# Altium project AVCC_PROJECT.PrjPcb
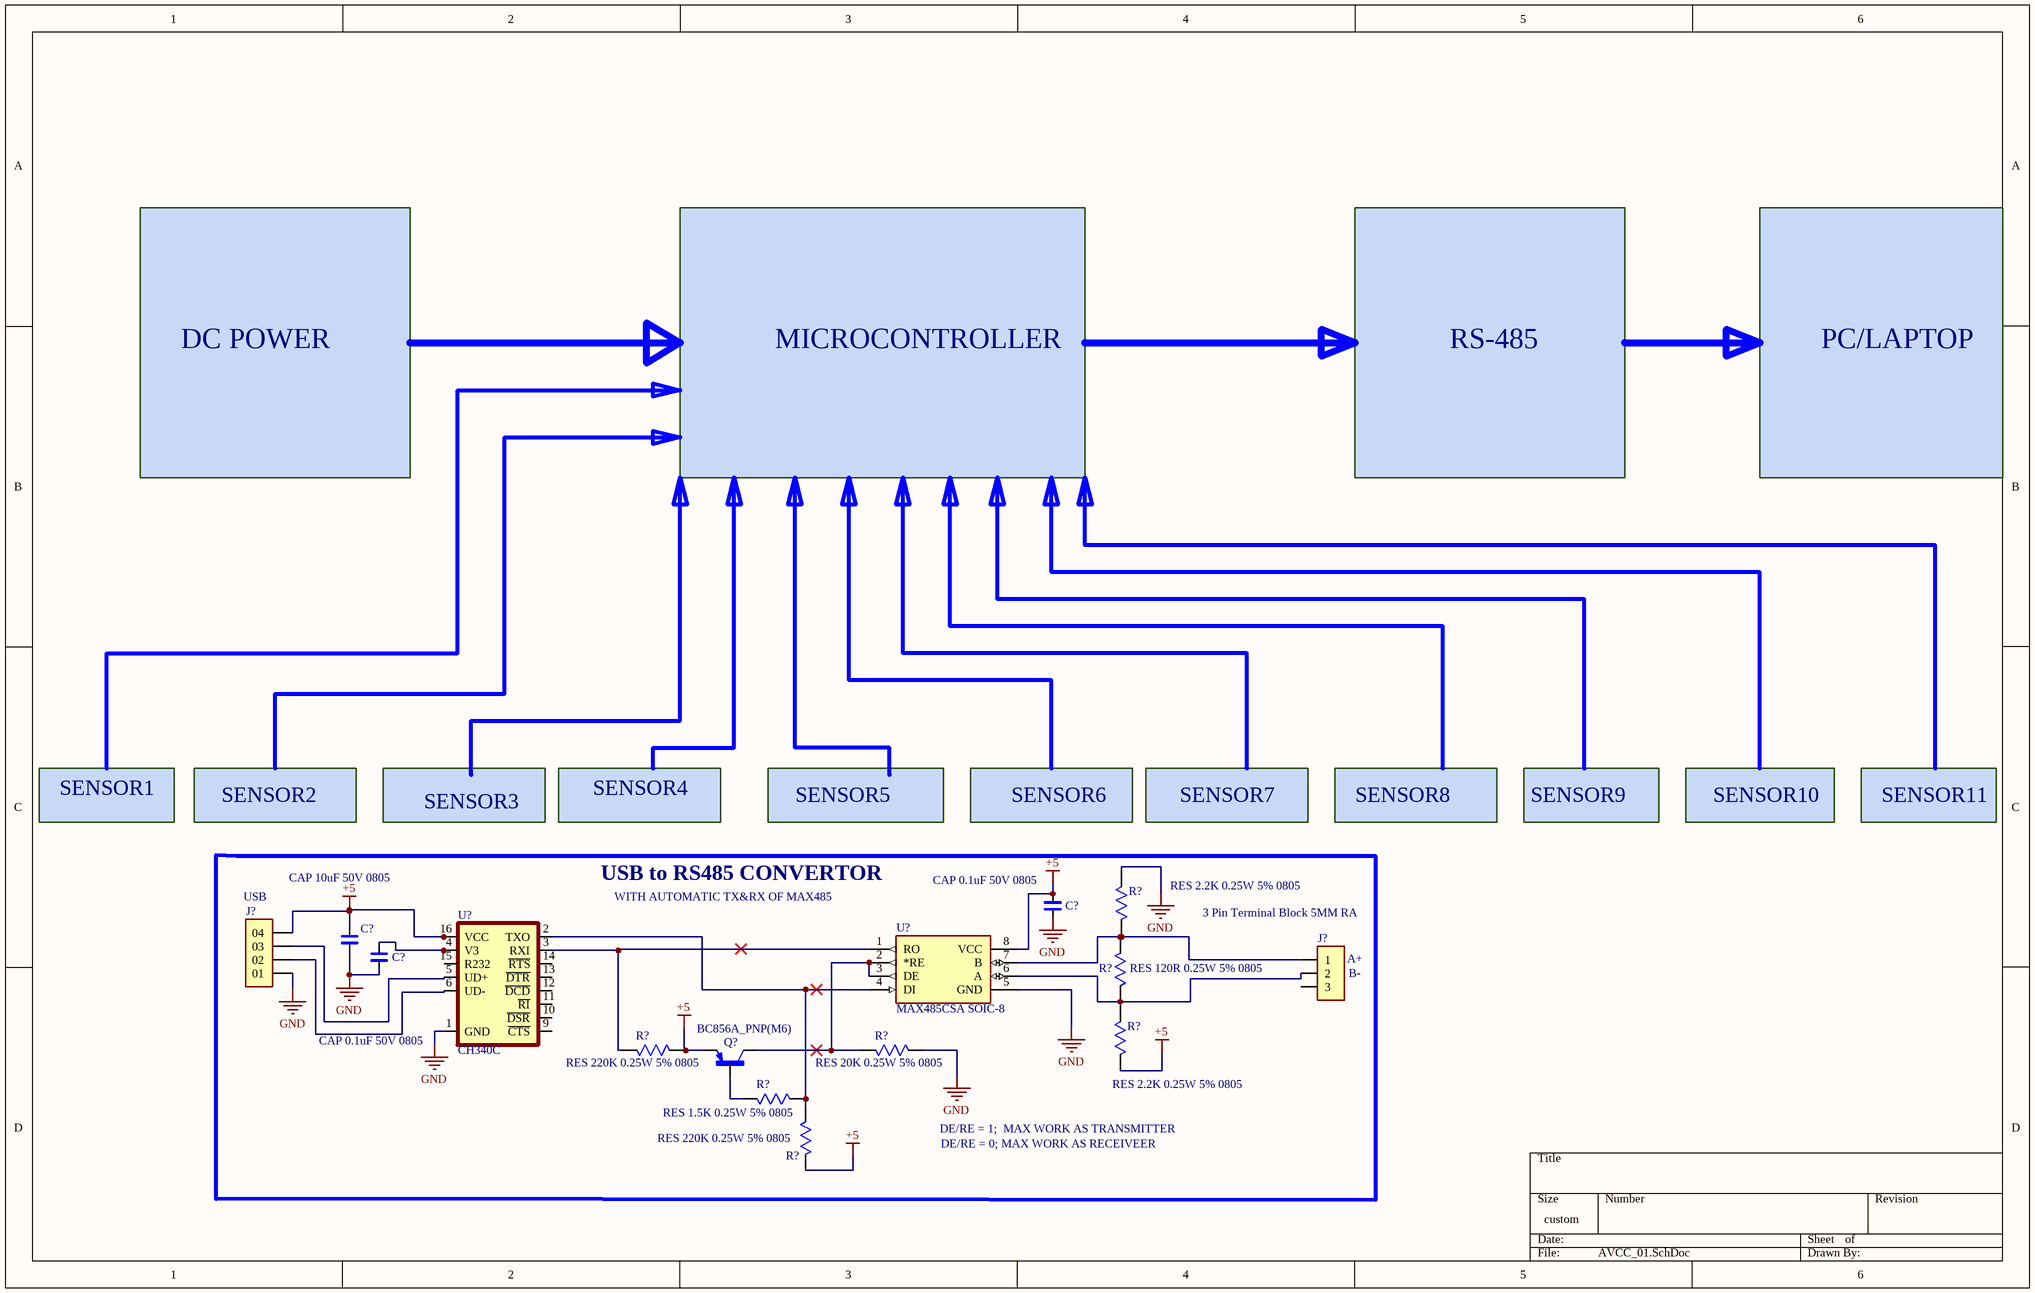
[diagram p0: AVCC_01.SchDoc]
3 sheets, 125 parts. Net scope: global (net labels, ports and power ports of the same name join across sheets).
Board file: AVCC_PROJECT.PcbDoc
Sheets:
  AVCC_01.SchDoc
  AVCC_2.SchDoc
  AVCC_3.SchDoc

## Sheet AVCC_01.SchDoc
size 381 x 241 mm; SheetNumber: 1; SheetTotal: 3

### Parts
(Parts that share a designator on the sheet are numbered #1, #2 ... from top to bottom, then left to right.)
C?#1  CAP 0.1uF 50V 0805  [CAP CER 0.1uF/50V 5%]
C?#2  CAP 10uF 50V 0805  [CAP CER 0.1uF/50V 5%]
C?#3  CAP 0.1uF 50V 0805  [CAP CER 0.1uF/50V 5%]
J?#1  USB  [BURGE 4 PIN 2.54mm]
J?#2  3 Pin Terminal Block 5MM RA  [3 Pin Terminal Block 5MM RA]
Q?  BC856A_PNP(M6)  [TRANS_BC856A_RFG]
R?#1  RES 2.2K 0.25W 5% 0805  [RES 0805 10K/0.25W 5%]
R?#2  RES 120R 0.25W 5% 0805  [RES 0805 10K/0.25W 5%]
R?#3  RES 2.2K 0.25W 5% 0805  [RES 0805 10K/0.25W 5%]
R?#4  RES 220K 0.25W 5% 0805  [RES 0805 10K/0.25W 5%]
R?#5  RES 20K 0.25W 5% 0805  [RES 0805 10K/0.25W 5%]
R?#6  RES 1.5K 0.25W 5% 0805  [RES 0805 10K/0.25W 5%]
R?#7  RES 220K 0.25W 5% 0805  [RES 0805 10K/0.25W 5%]
U?#1  MAX485CSA SOIC-8  [MAX485CSA]
U?#2  CH340C  [SO016]

### Nets
+5: C?#1.1 C?#2.1 J?#1.04 Q?.2(E) R?#3.2 R?#4.2 R?#7.2 U?#1.8(VCC) U?#2.16(VCC)
GND: C?#1.2 C?#2.2 C?#3.2 J?#1.01 R?#1.1 R?#5.2 U?#1.5(GND) U?#2.1(GND)
NetC?#3_1: C?#3.1 U?#2.4(V3)
NetJ?#1_02: J?#1.02 U?#2.6(UD-)
NetJ?#1_03: J?#1.03 U?#2.5(UD+)
NetJ?#2_1: J?#2.1 R?#1.2 R?#2.1 U?#1.7(B)
NetJ?#2_2: J?#2.2 R?#2.2 R?#3.1 U?#1.6(A)
NetQ?_1: Q?.1(B) R?#6.1
NetQ?_3: Q?.3(C) R?#5.1 U?#1.2(*RE) U?#1.3(DE)
NetR?#4_1: R?#4.1 U?#1.1(RO) U?#2.3(RXI)
NetR?#6_2: R?#6.2 R?#7.1 U?#1.4(DI) U?#2.2(TXO)

Not connected (* = marked no-connect by the designer): J?#2 3; U?#2 9(~{CTS}) 10(~{DSR}) 11(~{RI}) 12(~{DCD}) 13(~{DTR}) 14(~{RTS}) 15(R232)

### Notes on the sheet
- DC POWER
- MICROCONTROLLER
- RS-485
- PC/LAPTOP
- SENSOR1
- SENSOR2
- SENSOR3
- SENSOR4
- SENSOR5
- SENSOR6
- SENSOR7
- SENSOR8
- SENSOR9
- SENSOR10
- SENSOR11
- USB to RS485 CONVERTOR
- WITH AUTOMATIC TX&RX OF MAX485
- (near J?#2) A+
- (near J?#2) B-
- DE/RE = 1;  MAX WORK AS TRANSMITTER
- DE/RE = 0; MAX WORK AS RECEIVEER

### Library data of the parts
C?#1-C?#3 = CAP CER 0.1uF/50V 5%: CAP CER 0.1uF/50V  Ceramic Capacitor X7R 0805 (2012 Metric) SMT; MF: Samsung; MP: CL21B104KCFNNNE; Purchase-URL: https://pricing.snapeda.com/search?q=CL21B104KCFNNNE&ref=eda; Package: 0805 Samsung; Check_prices: https://www.snapeda.com/parts/CL21B104KCFNNNE/Samsung+Electro-Mechanics/view-part/?ref=eda; Value: *; SnapEDA_Link: https://www.snapeda.com/parts/CL21B104KCFNNNE/Samsung+Electro-Mechanics/view-part/?ref=snap; Digi-Key_Part_Number: 1276-6840-2-ND
J?#1 = BURGE 4 PIN 2.54mm: Conn Unshrouded Header HDR 4 POS 2.54mm Solder ST Top Entry Thru-Hole Bulk TSW-104-17-G-S-LL; MF: Samtec; MP: TSW-104-23-H-S-LL; SnapEDA_Link: https://www.snapeda.com/parts/TSW-104-23-H-S-LL/Samtec/view-part/?ref=snap; Package: None; Value: *; Check_prices: https://www.snapeda.com/parts/TSW-104-23-H-S-LL/Samtec/view-part/?ref=eda
J?#2 = 3 Pin Terminal Block 5MM RA: 3 Pin Terminal Block HDR 5MM THT RA 231-433_001-000; MP: 231-433/001-000; MF: WAGO; SnapEDA_Link: https://www.snapeda.com/parts/231-433/001-000/WAGO/view-part/482062/?ref=snap; Package: None; Availability: Unavailable; Price: None; Value: *
Q? = BC856A_RFG: Package: None; Price: None; Value: *; MP: BC856A_RFG; Availability: Unavailable
R?#1-R?#7 = RES 10K 0.25W 5% 0805: RESISTOR, THICK FILM, 10K, 5%, 0805 0.25W SMT; MP: ERJ-6GEYJ103V; MF: Panasonic Electronic; Price: None; Check_prices: https://www.snapeda.com/parts/ERJ-6GEYJ103V/Panasonic+Electronic+Components/view-part/?ref=eda; Package: 805-2 Panasonic; Purchase-URL: https://pricing.snapeda.com/search/part/ERJ-6GEYJ103V/?ref=eda; Availability: In Stock; SnapEDA_Link: https://www.snapeda.com/parts/ERJ-6GEYJ103V/Panasonic+Electronic+Components/view-part/?ref=snap; Value: *
U?#1 = MAX485CSA: MAX485CSA-RS-485/RS-422 Transceivers, SOIC-8; MF: Analog Devices; MP: MAX485CSA+; SnapEDA_Link: https://www.snapeda.com/parts/MAX485CSA+/Analog+Devices/view-part/?ref=snap; Package: SOIC-8 Maxim; Value: *; Check_prices: https://www.snapeda.com/parts/MAX485CSA+/Analog+Devices/view-part/?ref=eda
U?#2 = CH340C: Replacement for Brother P-Touch; MF: Olimex; SnapEDA_Link: https://www.snapeda.com/parts/CH340C/Olimex/view-part/?ref=snap; Package: None; Value: *; MP: CH340C; Check_prices: https://www.snapeda.com/parts/CH340C/Olimex/view-part/?ref=eda

## Sheet AVCC_2.SchDoc
size 381 x 241 mm; SheetNumber: 2; SheetTotal: 3
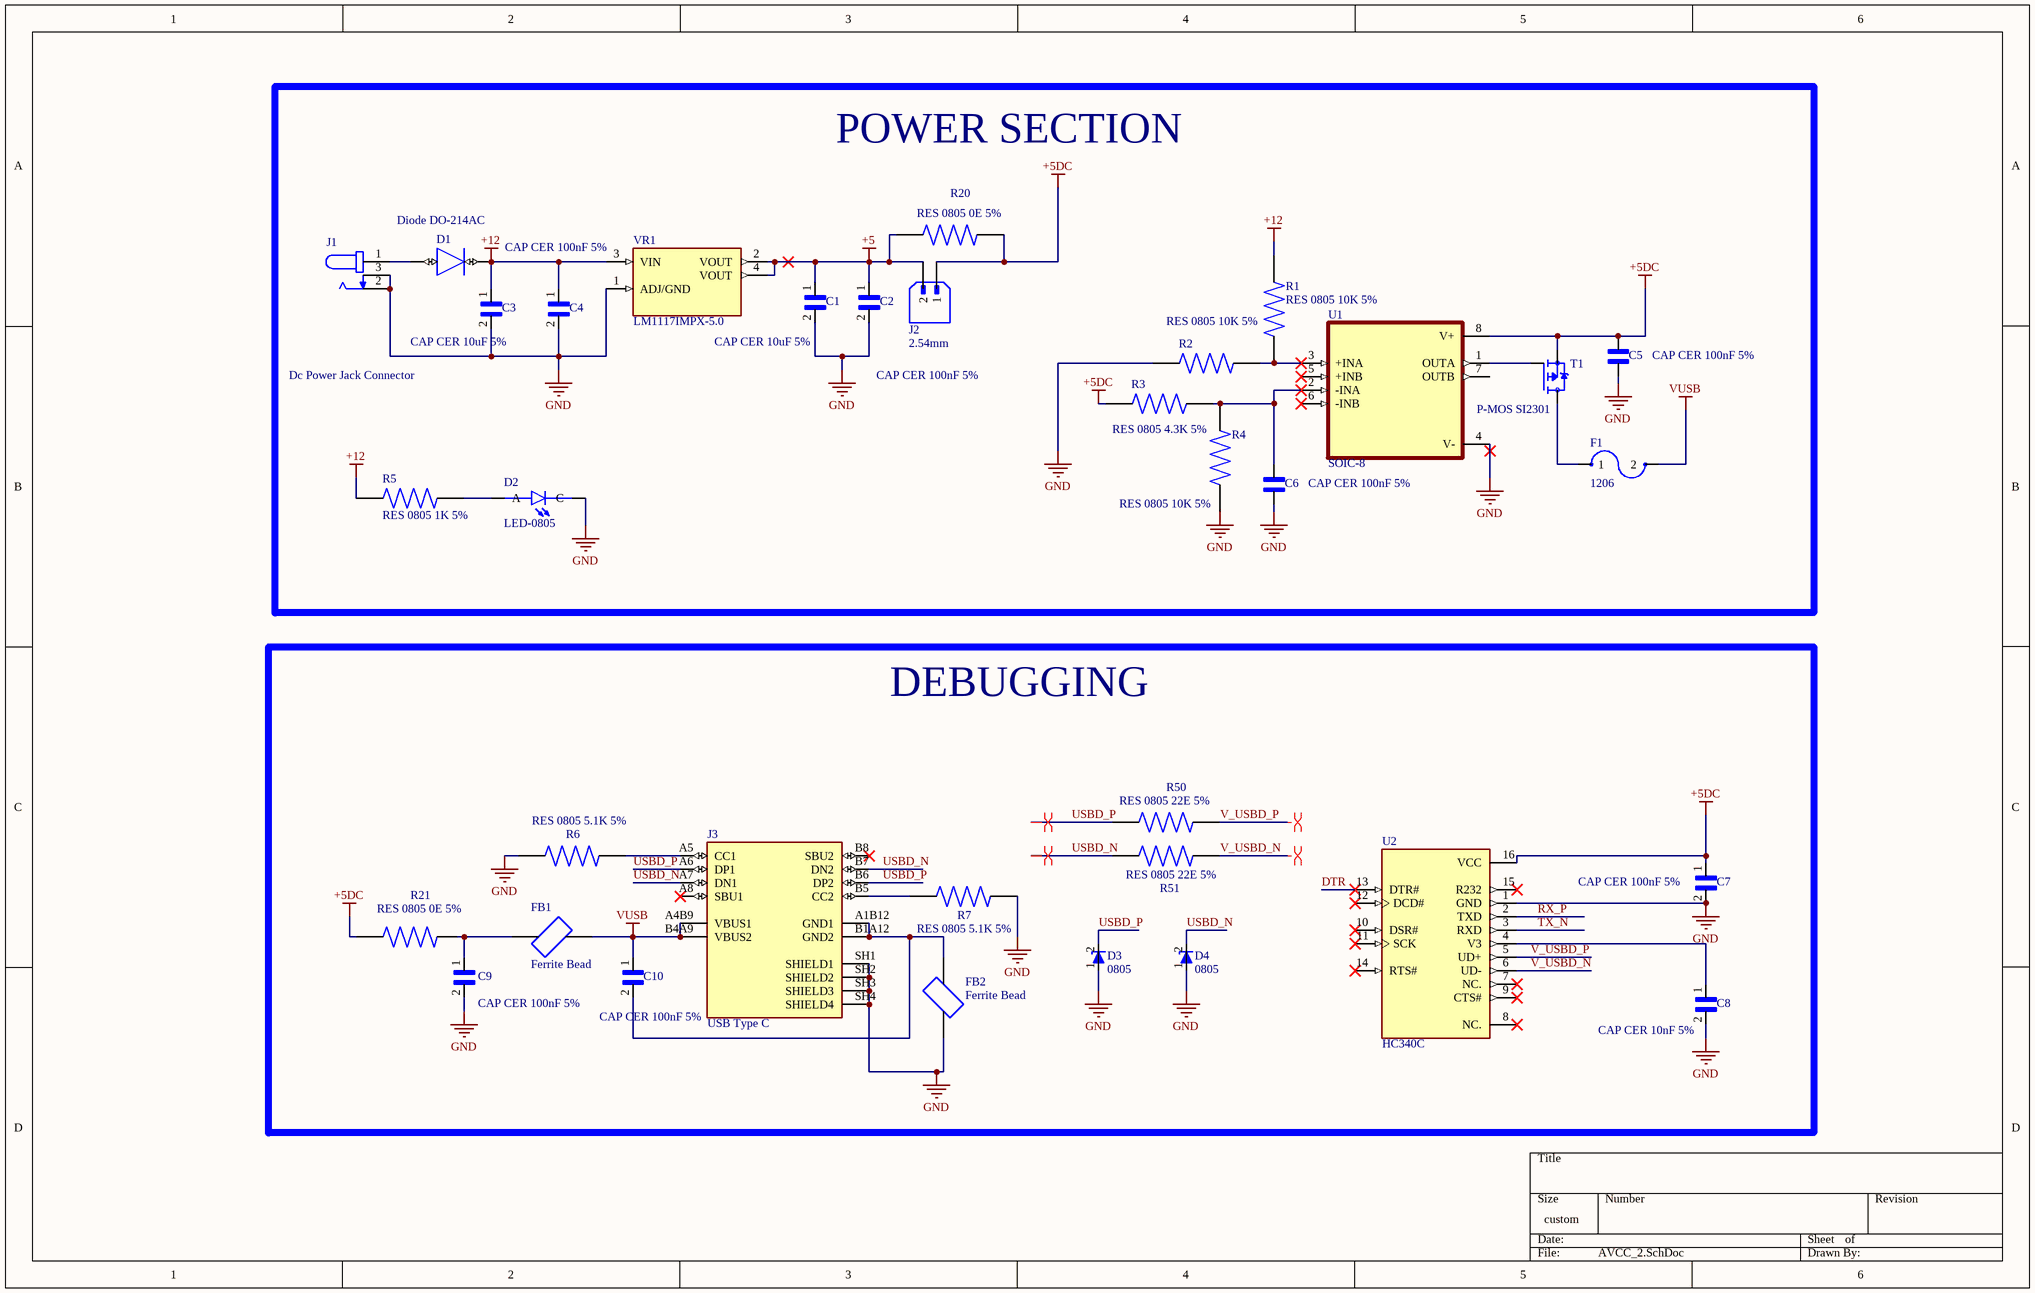
[diagram p1: AVCC_2.SchDoc]

### Parts
C1  CAP CER 10uF 5%  [CAP CER 100pF 5%]
C2  CAP CER 100nF 5%  [CAP CER 100pF 5%]
C3  CAP CER 10uF 5%  [CAP CER 100pF 5%]
C4  CAP CER 100nF 5%  [CAP CER 100pF 5%]
C5  CAP CER 100nF 5%  [CAP CER 100pF 5%]
C6  CAP CER 100nF 5%  [CAP CER 100pF 5%]
C7  CAP CER 100nF 5%  [CAP CER 100pF 5%]
C8  CAP CER 10nF 5%  [CAP CER 100pF 5%]
C9  CAP CER 100nF 5%  [CAP CER 100pF 5%]
C10  CAP CER 100nF 5%  [CAP CER 100pF 5%]
D1  Diode DO-214AC  [Diode DO-214AC]
D2  LED-0805  [LED-0805]
D3  0805  [TVS Diode,Uni-Directional, 4-Pin]
D4  0805  [TVS Diode,Uni-Directional, 4-Pin]
F1  1206  [FUSE]
FB1  Ferrite Bead  [Ferrite Bead]
FB2  Ferrite Bead  [Ferrite Bead]
J1  Dc Power Jack Connector  [Dc Power Jack Connector]
J2  2.54mm  [JST_2PIN]
J3  USB Type C  [USB Type C MOLEX]
R1  RES 0805 10K 5%  [RES 0805 10K 5%]
R2  RES 0805 10K 5%  [RES 0805 10K 5%]
R3  RES 0805 4.3K 5%  [RES 0805 10K 5%]
R4  RES 0805 10K 5%  [RES 0805 10K 5%]
R5  RES 0805 1K 5%  [RES 0805 10K 5%]
R6  RES 0805 5.1K 5%  [RES 0805 10K 5%]
R7  RES 0805 5.1K 5%  [RES 0805 10K 5%]
R20  RES 0805 0E 5%  [RES 0805 10K 5%]
R21  RES 0805 0E 5%  [RES 0805 10K 5%]
R50  RES 0805 22E 5%  [RES 0805 10K 5%]
R51  RES 0805 22E 5%  [RES 0805 10K 5%]
T1  P-MOS SI2301  [PMOS_SOT23]
U1  SOIC-8  [OPAMP]
U2  HC340C  [HC340C]
VR1  LM1117IMPX-5.0  [LM1117IMPX-5.0]

### Blocks framed on the sheet
POWER SECTION: C1-C6 D1 D2 F1 J1 J2 R1-R5 R20 T1 U1 VR1
DEBUGGING: C7-C10 D3 D4 FB1 FB2 J3 R6 R7 R21 R50 R51 U2

### Nets
+5: C1.1 C2.1 J2.2 R20.1 VR1.2(VOUT) VR1.4(VOUT)
+5DC: C5.1 C7.1 J2.1 R3.1 R20.2 R21.1 T1.2(S) U1.8(V+) U2.16(VCC)
+12: C3.1 C4.1 D1.1(K) R1.2 R5.1 VR1.3(VIN)
GND: C1.2 C2.2 C3.2 C4.2 C5.2 C6.2 C7.2 C8.2 C9.2 D2.C D3.1(GND) D4.1(GND) FB2.1 J1.2 J1.3 J3.SH1(SHIELD1) J3.SH2(SHIELD2) J3.SH3(SHIELD3) J3.SH4(SHIELD4) R2.1 R4.1 R6.1 R7.2 U1.4(V-) U2.1(GND) VR1.1(ADJ/GND)
VUSB: C10.1 F1.2 FB1.2 J3.A4B9(VBUS1) J3.B4A9(VBUS2)
DTR: U2.13(DTR#)
RX_P: U2.2(TXD)
TX_N: U2.3(RXD)
USBD_N: D4.2(I/O_1) J3.A7(DN1) J3.B7(DN2) R51.1
USBD_P: D3.2(I/O_1) J3.A6(DP1) J3.B6(DP2) R50.1
V_USBD_N: R51.2 U2.6(UD-)
V_USBD_P: R50.2 U2.5(UD+)
NetC6_1: C6.1 R3.2 R4.2 U1.2(-INA)
NetC8_1: C8.1 U2.4(V3)
NetC9_1: C9.1 FB1.1 R21.2
NetC10_2: C10.2 FB2.2 J3.A1B12(GND1) J3.B1A12(GND2)
NetD1_2: D1.2(A) J1.1
NetD2_A: D2.A R5.2
NetF1_1: F1.1 T1.3(D)
NetJ3_A5: J3.A5(CC1) R6.2
NetJ3_B5: J3.B5(CC2) R7.1
NetR1_1: R1.1 R2.2 U1.3(+INA)
NetT1_1: T1.1(G) U1.1(OUTA)

Not connected (* = marked no-connect by the designer): J3 A8(SBU1)* B8(SBU2)*; U1 5(+INB)* 6(-INB)* 7(OUTB); U2 7(NC.)* 8(NC.)* 9(CTS#)* 10(DSR#)* 11(SCK)* 12(DCD#)* 14(RTS#)* 15(R232)*

### Layout directives
differential pair; differential pair class DIFF_90E: USBD_N, USBD_P, V_USBD_N, V_USBD_P

### Library data of the parts
C1-C10 = CAP CER 100pF 5%: CAP CER 100PF50V X7R 0805; MP: GCJ216R71H222KA01D; Package: None; Price: None; Value: *; Availability: Unavailable
D1 = Diode DO-214AC: Diode Standard 100 V 1A Surface Mount DO-214AC (SMA); MF: Vishay Semiconductor; MP: S1B-E3/61T; SnapEDA_Link: https://www.snapeda.com/parts/S1B-E3/61T/Vishay/view-part/?ref=snap; Package: DO-214 Vishay Semiconductor; Value: *; Check_prices: https://www.snapeda.com/parts/S1B-E3/61T/Vishay/view-part/?ref=eda
D2 = LED-0805: Red 640nm LED Indication - Discrete 1.85V 0805 (2012 Metric); MF: Kingbright; MP: APT2012SRCPRV; SnapEDA_Link: https://www.snapeda.com/parts/APT2012SRCPRV/Kingbright/view-part/?ref=snap; Package: 0805 Kingbright; Value: *; Check_prices: https://www.snapeda.com/parts/APT2012SRCPRV/Kingbright/view-part/?ref=eda
D3 D4 = TVS Diode: Nexperia PRTR5V0U2X,215, Dual-Element Uni-Directional TVS Diode, 0805, 5V; MF: NXP Semiconductors; Check_prices: https://www.snapeda.com/parts/PRTR5V0U2X/NXP+Semiconductors/view-part/?ref=eda; Value: *; Purchase-URL: https://pricing.snapeda.com/search/part/PRTR5V0U2X/?ref=eda; Price: None; MP: PRTR5V0U2X; SnapEDA_Link: https://www.snapeda.com/parts/PRTR5V0U2X/NXP+Semiconductors/view-part/?ref=snap; Availability: In Stock; Package: TO-253-4 Nexperia USA Inc.
F1 = FUSE: C1H25 .5 A 125 V AC 32 V DC Fuse Board Mount (Cartridge Style Excluded) Surface Mount 1206 (3216 Metric); MF: Bel Fuse; SnapEDA_Link: https://www.snapeda.com/parts/C1H25/Bel+Circuit+Protection/view-part/?ref=snap; Package: 1206 Bel Fuse Inc.; Value: *; MP: C1H25; Check_prices: https://www.snapeda.com/parts/C1H25/Bel+Circuit+Protection/view-part/?ref=eda
FB1 FB2 = Ferrite Bead: Ferrite Bead 0805; MP: MPZ2012S102AT000; Package: None; Price: None; Value: *; Availability: Unavailable
J1 = Dc Power Jack Connector: PJ-202AH, 2.0 x 6.5 mm, 5.0 A, Horizontal, Through Hole, Kinked Pins, Dc Power Jack Connector; MF: Same Sky; SnapEDA_Link: https://www.snapeda.com/parts/PJ-202AH/Same+Sky/view-part/?ref=snap; Package: None; Value: *; MP: PJ-202AH; Check_prices: https://www.snapeda.com/parts/PJ-202AH/Same+Sky/view-part/?ref=eda
J2 = JST_2PIN: B2B-XH-A(LF)(SN),Connector Header Through Hole 3 position 0.098 (2.50mm)Connector Header Through Hole 2 position 0.098 (2.50mm); MF: JST Sales; SnapEDA_Link: https://www.snapeda.com/parts/B2B-XH-A(LF)(SN)/JST/view-part/?ref=snap; Package: None; Value: *; MP: B2B-XH-A(LF)(SN); Check_prices: https://www.snapeda.com/parts/B2B-XH-A(LF)(SN)/JST/view-part/?ref=eda
J3 = USB Type C: USB Type C - Connector, Top-mount SMT, 16pos | Molex Incorporated 217179-0001; SnapEDA_Link: https://www.snapeda.com/parts/217179-0001/Molex/view-part/?ref=snap; Package: None; Value: *; MF: Molex; MP: 217179-0001; Check_prices: https://www.snapeda.com/parts/217179-0001/Molex/view-part/?ref=eda
R1-R7 R20 R21 R50 R51 = RES 0805 10K 5%: RESISTOR, THICK FILM, 10K, 5%, 0805, FRESISTOR, THICK FILM, 10K, 5%, 0805, FULL REEL Product Range:PANASONIC - ERJ Series; MP: ERJ-6GEYJ103V; MF: Panasonic Electronic; Price: None; Check_prices: https://www.snapeda.com/parts/ERJ-6GEYJ103V/Panasonic+Electronic+Components/view-part/?ref=eda; Package: 805-2 Panasonic; Purchase-URL: https://pricing.snapeda.com/search/part/ERJ-6GEYJ103V/?ref=eda; Availability: In Stock; SnapEDA_Link: https://www.snapeda.com/parts/ERJ-6GEYJ103V/Panasonic+Electronic+Components/view-part/?ref=snap; Value: *
T1 = P-MOS SI2301: MOSFET P-CH 20V 2.2A SOT23-3; MF: Micro Commercial Components (MCC); SnapEDA_Link: https://www.snapeda.com/parts/SI2301/Micro+Commercial+Components/view-part/?ref=snap; Package: SOT-23 MCC; Value: *; MP: SI2301; Check_prices: https://www.snapeda.com/parts/SI2301/Micro+Commercial+Components/view-part/?ref=eda
U1 = OPAMP: LMV342MA,Dual, 5.5-V, 1-MHz, high output current (75-mA) op amp,SOIC-8; MF: Texas Instruments; MP: LMV342MAX/NOPB; SnapEDA_Link: https://www.snapeda.com/parts/LMV342MAX/NOPB/Texas+Instruments/view-part/?ref=snap; Package: SOIC-8 Texas Instruments; Value: *; Check_prices: https://www.snapeda.com/parts/LMV342MAX/NOPB/Texas+Instruments/view-part/?ref=eda
U2 = HC340C: FTDI 16-SOIC; MF: Toshiba; MP: 74HC595D; SnapEDA_Link: https://www.snapeda.com/parts/74HC595D/Toshiba/view-part/?ref=snap; Package: SOIC-16 ON Semiconductor; Value: *; Check_prices: https://www.snapeda.com/parts/74HC595D/Toshiba/view-part/?ref=eda
VR1 = LM1117IMPX-5.0: 800-mA 15-V linear voltage regulator; MF: Texas Instruments; MP: LM1117IMPX-5.0/NOPB; SnapEDA_Link: https://www.snapeda.com/parts/LM1117IMPX-5.0/NOPB/Texas+Instruments/view-part/?ref=snap; Package: SOT-223-4 Texas Instruments; Value: *; Check_prices: https://www.snapeda.com/parts/LM1117IMPX-5.0/NOPB/Texas+Instruments/view-part/?ref=eda

## Sheet AVCC_3.SchDoc
size 381 x 241 mm; SheetNumber: 3; SheetTotal: 3
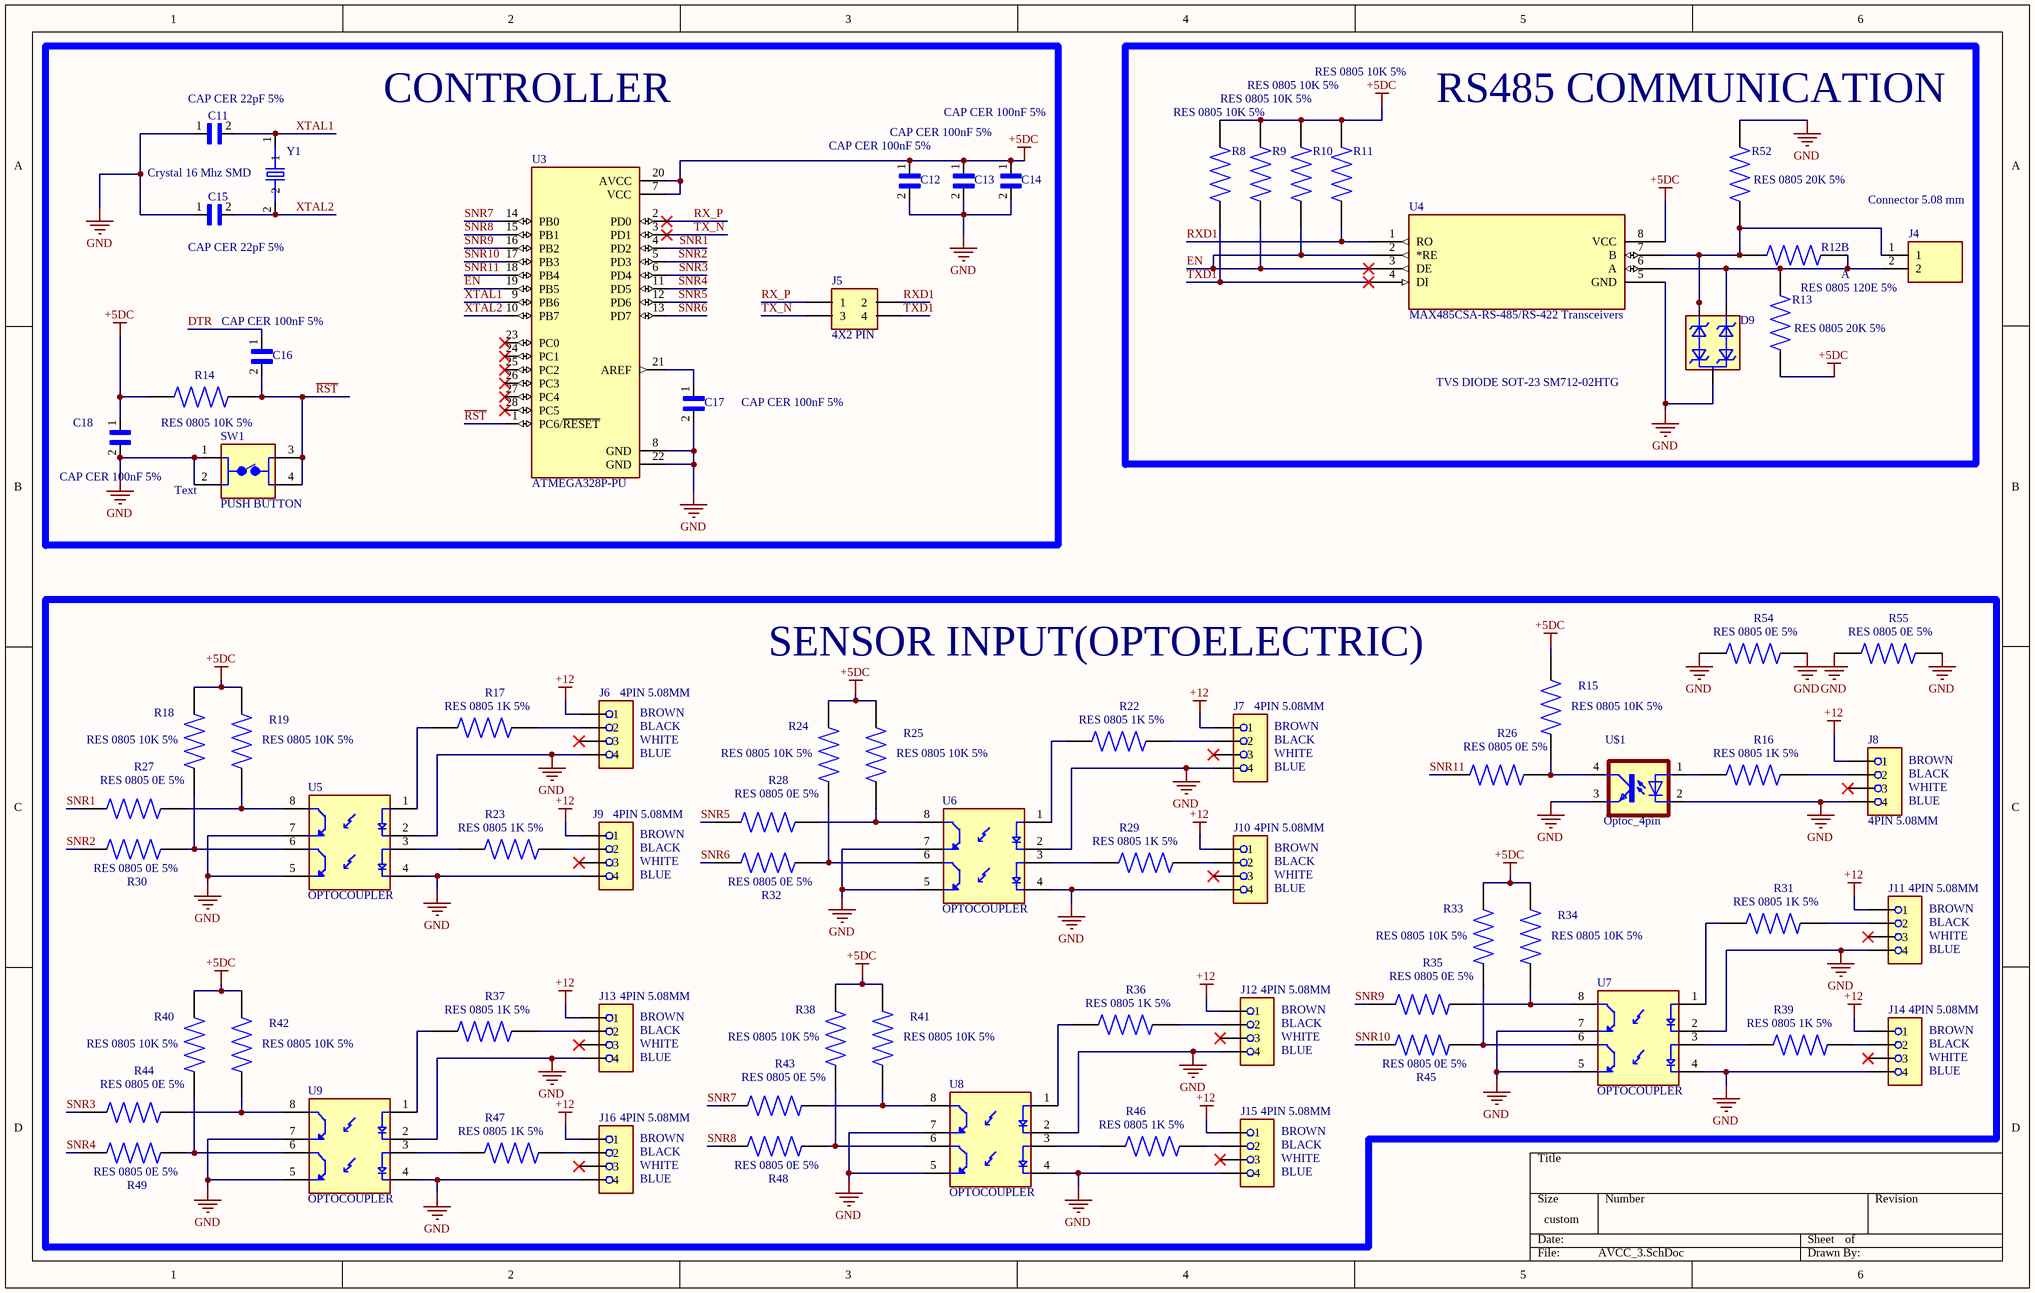
[diagram p2: AVCC_3.SchDoc]

### Parts
C11  CAP CER 22pF 5%  [CAP CER 100pF 5%]
C12  CAP CER 100nF 5%  [CAP CER 100pF 5%]
C13  CAP CER 100nF 5%  [CAP CER 100pF 5%]
C14  CAP CER 100nF 5%  [CAP CER 100pF 5%]
C15  CAP CER 22pF 5%  [CAP CER 100pF 5%]
C16  CAP CER 100nF 5%  [CAP CER 100pF 5%]
C17  CAP CER 100nF 5%  [CAP CER 100pF 5%]
C18  CAP CER 100nF 5%  [CAP CER 100pF 5%]
D9  TVS DIODE SOT-23 SM712-02HTG  [TVS Diode SOT23]
J4  Connector 5.08 mm  [Connector 5.08 mm]
J5  4X2 PIN  [4PIN BURGE]
J6  4PIN 5.08MM  [TERMINSL SCREW]
J7  4PIN 5.08MM  [TERMINSL SCREW]
J8  4PIN 5.08MM  [TERMINSL SCREW]
J9  4PIN 5.08MM  [TERMINSL SCREW]
J10  4PIN 5.08MM  [TERMINSL SCREW]
J11  4PIN 5.08MM  [TERMINSL SCREW]
J12  4PIN 5.08MM  [TERMINSL SCREW]
J13  4PIN 5.08MM  [TERMINSL SCREW]
J14  4PIN 5.08MM  [TERMINSL SCREW]
J15  4PIN 5.08MM  [TERMINSL SCREW]
J16  4PIN 5.08MM  [TERMINSL SCREW]
R8  RES 0805 10K 5%  [RES 0805 10K 5%]
R9  RES 0805 10K 5%  [RES 0805 10K 5%]
R10  RES 0805 10K 5%  [RES 0805 10K 5%]
R11  RES 0805 10K 5%  [RES 0805 10K 5%]
R12  RES 0805 120E 5%  [RES 0805 10K 5%]
R13  RES 0805 20K 5%  [RES 0805 10K 5%]
R14  RES 0805 10K 5%  [RES 0805 10K 5%]
R15  RES 0805 10K 5%  [RES 0805 10K 5%]
R16  RES 0805 1K 5%  [RES 0805 10K 5%]
R17  RES 0805 1K 5%  [RES 0805 10K 5%]
R18  RES 0805 10K 5%  [RES 0805 10K 5%]
R19  RES 0805 10K 5%  [RES 0805 10K 5%]
R22  RES 0805 1K 5%  [RES 0805 10K 5%]
R23  RES 0805 1K 5%  [RES 0805 10K 5%]
R24  RES 0805 10K 5%  [RES 0805 10K 5%]
R25  RES 0805 10K 5%  [RES 0805 10K 5%]
R26  RES 0805 0E 5%  [RES 0805 10K 5%]
R27  RES 0805 0E 5%  [RES 0805 10K 5%]
R28  RES 0805 0E 5%  [RES 0805 10K 5%]
R29  RES 0805 1K 5%  [RES 0805 10K 5%]
R30  RES 0805 0E 5%  [RES 0805 10K 5%]
R31  RES 0805 1K 5%  [RES 0805 10K 5%]
R32  RES 0805 0E 5%  [RES 0805 10K 5%]
R33  RES 0805 10K 5%  [RES 0805 10K 5%]
R34  RES 0805 10K 5%  [RES 0805 10K 5%]
R35  RES 0805 0E 5%  [RES 0805 10K 5%]
R36  RES 0805 1K 5%  [RES 0805 10K 5%]
R37  RES 0805 1K 5%  [RES 0805 10K 5%]
R38  RES 0805 10K 5%  [RES 0805 10K 5%]
R39  RES 0805 1K 5%  [RES 0805 10K 5%]
R40  RES 0805 10K 5%  [RES 0805 10K 5%]
R41  RES 0805 10K 5%  [RES 0805 10K 5%]
R42  RES 0805 10K 5%  [RES 0805 10K 5%]
R43  RES 0805 0E 5%  [RES 0805 10K 5%]
R44  RES 0805 0E 5%  [RES 0805 10K 5%]
R45  RES 0805 0E 5%  [RES 0805 10K 5%]
R46  RES 0805 1K 5%  [RES 0805 10K 5%]
R47  RES 0805 1K 5%  [RES 0805 10K 5%]
R48  RES 0805 0E 5%  [RES 0805 10K 5%]
R49  RES 0805 0E 5%  [RES 0805 10K 5%]
R52  RES 0805 20K 5%  [RES 0805 10K 5%]
R54  RES 0805 0E 5%  [RES 0805 10K 5%]
R55  RES 0805 0E 5%  [RES 0805 10K 5%]
SW1  PUSH BUTTON  [Push Button]
U3  ATMEGA328P-PU  [ATMEGA328P DIP28]
U4  MAX485CSA-RS-485/RS-422 Transceivers  [MAX485CSA-RS-485/RS-422 Transceivers]
U5  OPTOCOUPLER  [OPTOCOUPLER]
U6  OPTOCOUPLER  [OPTOCOUPLER]
U7  OPTOCOUPLER  [OPTOCOUPLER]
U8  OPTOCOUPLER  [OPTOCOUPLER]
U9  OPTOCOUPLER  [OPTOCOUPLER]
U$1  Optoc_4pin  [Optoisolator]
Y1  Crystal 16 Mhz SMD  [Crystal 16 Mhz SMD]

### Blocks framed on the sheet
CONTROLLER: C11-C18 J5 R14 SW1 U3 Y1
RS485 COMMUNICATION: D9 J4 R8-R13 R52 U4
SENSOR INPUT(OPTOELECTRIC): J6-J16 R15-R19 R22-R49 R54 R55 U5-U9 U$1

### Nets
+5DC: C12.1 C13.1 C14.1 C18.1 R8.2 R9.2 R10.2 R11.2 R13.1 R14.1 R15.2 R18.2 R19.2 R24.2 R25.2 R33.2 R34.2 R38.2 R40.2 R41.2 R42.2 U3.7(VCC) U3.20(AVCC) U4.8(VCC)
+12: J6.1 J7.1 J8.1 J9.1 J10.1 J11.1 J12.1 J13.1 J14.1 J15.1 J16.1
GND: C11.1 C12.2 C13.2 C14.2 C15.1 C17.2 C18.2 D9.3 J6.4 J7.4 J8.4 J9.4 J10.4 J11.4 J12.4 J13.4 J14.4 J15.4 J16.4 R52.2 R54.1 R54.2 R55.1 R55.2 SW1.1 SW1.2 U3.8(GND) U3.22(GND) U4.5(GND) U5.2 U5.4 U5.5 U5.7 U6.2 U6.4 U6.5 U6.7 U7.2 U7.4 U7.5 U7.7 U8.2 U8.4 U8.5 U8.7 U9.2 U9.4 U9.5 U9.7 U$1.2(C) U$1.3(EMIT)
DTR: C16.1
EN: R9.1 R10.1 U3.19(PB5) U4.2(*RE) U4.3(DE)
~{RST}: C16.2 R14.2 SW1.3 SW1.4 U3.1(PC6/~{RESET})
RX_P: J5.01(1) U3.2(PD0)
RXD1: J5.02(2) R11.1 U4.1(RO)
SNR1: R27.1 U3.4(PD2)
SNR2: R30.1 U3.5(PD3)
SNR3: R44.1 U3.6(PD4)
SNR4: R49.1 U3.11(PD5)
SNR5: R28.1 U3.12(PD6)
SNR6: R32.1 U3.13(PD7)
SNR7: R43.1 U3.14(PB0)
SNR8: R48.1 U3.15(PB1)
SNR9: R35.1 U3.16(PB2)
SNR10: R45.1 U3.17(PB3)
SNR11: R26.1 U3.18(PB4)
TX_N: J5.03(3) U3.3(PD1)
TXD1: J5.04(4) R8.1 U4.4(DI)
XTAL1: C11.2 U3.9(PB6) Y1.1
XTAL2: C15.2 U3.10(PB7) Y1.2
NetC17_1: C17.1 U3.21(AREF)
NetD9_1: D9.1 J4.2 R12.2 R13.2 U4.6(A)
NetD9_2: D9.2 J4.1 R12.1 R52.1 U4.7(B)
NetJ6_2: J6.2 R17.1
NetJ7_2: J7.2 R22.1
NetJ8_2: J8.2 R16.1
NetJ9_2: J9.2 R23.1
NetJ10_2: J10.2 R29.1
NetJ11_2: J11.2 R31.1
NetJ12_2: J12.2 R36.1
NetJ13_2: J13.2 R37.1
NetJ14_2: J14.2 R39.1
NetJ15_2: J15.2 R46.1
NetJ16_2: J16.2 R47.1
NetR15_1: R15.1 R26.2 U$1.4(COL)
NetR16_2: R16.2 U$1.1(A)
NetR17_2: R17.2 U5.1
NetR18_1: R18.1 R30.2 U5.6
NetR19_1: R19.1 R27.2 U5.8
NetR22_2: R22.2 U6.1
NetR23_2: R23.2 U5.3
NetR24_1: R24.1 R32.2 U6.6
NetR25_1: R25.1 R28.2 U6.8
NetR29_2: R29.2 U6.3
NetR31_2: R31.2 U7.1
NetR33_1: R33.1 R45.2 U7.6
NetR34_1: R34.1 R35.2 U7.8
NetR36_2: R36.2 U8.1
NetR37_2: R37.2 U9.1
NetR38_1: R38.1 R48.2 U8.6
NetR39_2: R39.2 U7.3
NetR40_1: R40.1 R49.2 U9.6
NetR41_1: R41.1 R43.2 U8.8
NetR42_1: R42.1 R44.2 U9.8
NetR46_2: R46.2 U8.3
NetR47_2: R47.2 U9.3

Not connected (* = marked no-connect by the designer): J6 3*; J7 3*; J8 3*; J9 3*; J10 3*; J11 3*; J12 3*; J13 3*; J14 3*; J15 3*; J16 3*; U3 23(PC0)* 24(PC1)* 25(PC2)* 26(PC3)* 27(PC4)* 28(PC5)*

### Notes on the sheet
- (near R12) A
- (near R12) B
- (near SW1) Text
- (near J6) BROWN
- (near J6) BLACK
- (near J6) WHITE
- (near J6) BLUE
- (near J7) BROWN
- (near J7) BLACK
- (near J7) WHITE
- (near J7) BLUE
- (near J8) BROWN
- (near J8) BLACK
- (near J9) BROWN
- (near J8) WHITE
- (near J8) BLUE
- (near J9) BLACK
- (near J9) WHITE
- (near J9) BLUE
- (near J10) BROWN
- (near J10) BLACK
- (near J10) WHITE
- (near J10) BLUE
- (near J11) BROWN
- (near J11) BLACK
- (near J11) WHITE
- (near J11) BLUE
- (near J13) BROWN
- (near J13) BLACK
- (near J13) WHITE
- (near J12) BROWN
- (near J12) BLACK
- (near J12) WHITE
- (near J14) BROWN
- (near J14) BLACK
- (near J13) BLUE
- (near J12) BLUE
- (near J14) WHITE
- (near J14) BLUE
- (near J16) BROWN
- (near J16) BLACK
- (near J16) WHITE
- (near J16) BLUE
- (near J15) BROWN
- (near J15) BLACK
- (near J15) WHITE
- (near J15) BLUE

### Library data of the parts
C11-C18 = CAP CER 100pF 5%: as C1 on sheet AVCC_2; Package: None; Price: None; Value: *; Availability: Unavailable
D9 = TVS DIODE SOT-23 SM712-02HTG: TVS Diode, SM712 Series, 31V Clamp, 600W Peak Pulse, Surface Mount,Bi-Directional, SOT23-3 | Littelfuse SM712-02HTG; MF: Littelfuse Inc.; SnapEDA_Link: https://www.snapeda.com/parts/SM712-02HTG/Littelfuse/view-part/?ref=snap; Package: SOT-23 Littelfuse Inc.; Value: *; MP: SM712-02HTG; Check_prices: https://www.snapeda.com/parts/SM712-02HTG/Littelfuse/view-part/?ref=eda
J4 = Connector 5.08 mm: MOLEX,Screw Type, Horizontal, 5.08 Pitch, 24~12 (AWG), Terminal Block Connector; MF: Same Sky; MP: TB007-508-02BE; SnapEDA_Link: https://www.snapeda.com/parts/TB007-508-02BE/Same+Sky/view-part/?ref=snap; Package: None; Value: *; Check_prices: https://www.snapeda.com/parts/TB007-508-02BE/Same+Sky/view-part/?ref=eda
J5 = 4PIN BURGE: Connector Header Through Hole 4 position 0.100 (2.54mm), 4X2 PIN; MF: Samtec; MP: MTLW-102-05-G-D-180; SnapEDA_Link: https://www.snapeda.com/parts/MTLW-102-05-G-D-180/Samtec/view-part/?ref=snap; Package: None; Value: *; Check_prices: https://www.snapeda.com/parts/MTLW-102-05-G-D-180/Samtec/view-part/?ref=eda
J6-J16 = TERMINSL SCREW: TERMINSL SCREW, 4PIN, 5.08MM; MF: {'manufacturer': u'Phoenix Contact'}; MP: 1995664; Package: None; Price: None; Value: *; Availability: Unavailable
R8-R19 R22-R49 R52 R54 R55 = RES 0805 10K 5%: as R1 on sheet AVCC_2; Price: None; Check_prices: https://www.snapeda.com/parts/ERJ-6GEYJ103V/Panasonic+Electronic+Components/view-part/?ref=eda; Package: 805-2 Panasonic; Purchase-URL: https://pricing.snapeda.com/search/part/ERJ-6GEYJ103V/?ref=eda; Availability: In Stock; SnapEDA_Link: https://www.snapeda.com/parts/ERJ-6GEYJ103V/Panasonic+Electronic+Components/view-part/?ref=snap; Value: *
SW1 = PUSH BUTTON: Switch Push Button OFF (ON) SPST Round Button 0.05A 24VDC Momentary Contact PC Pins Thru-Hole; MF: TE Connectivity; MP: 3-1825910-1; SnapEDA_Link: https://www.snapeda.com/parts/3-1825910-1/TE+Connectivity+ALCOSWITCH+Switches/view-part/?ref=snap; Package: None; Value: *; Check_prices: https://www.snapeda.com/parts/3-1825910-1/TE+Connectivity+ALCOSWITCH+Switches/view-part/?ref=eda
U3 = ATMEGA328P-PU: ATmega Series 20 MHz 32 KB Flash 2 KB SRAM 8-Bit Microcontroller - DIP-28; MP: ATMEGA328P-PU; Package: None; Availability: Unavailable; Price: None; Value: *
U4 = MAX485CSA-RS-485/RS-422 Transceivers: Low-Power, Slew-Rate-Limited RS-485/RS-422 Transceivers; MF: Analog Devices; MP: MAX485CSA+; SnapEDA_Link: https://www.snapeda.com/parts/MAX485CSA+/Analog+Devices/view-part/?ref=snap; Package: SOIC-8 Maxim; Value: *; Check_prices: https://www.snapeda.com/parts/MAX485CSA+/Analog+Devices/view-part/?ref=eda
U5-U9 = OPTOCOUPLER: TLP521-2,Optoisolateur Ã  sortie transistor 5300 Vrms 2 canaux 8 DIP; MF: Toshiba; SnapEDA_Link: https://www.snapeda.com/parts/TLP521-2/Toshiba/view-part/?ref=snap; Package: DIP-8 Toshiba; Value: *; MP: TLP521-2; Check_prices: https://www.snapeda.com/parts/TLP521-2/Toshiba/view-part/?ref=eda
U$1 = Optoc_4pin: TLP521-1,Optoisolator Transistor Output 5300Vrms 1 Channel 4-DIP; MF: Isocom; SnapEDA_Link: https://www.snapeda.com/parts/TLP521-1/Isocom/view-part/?ref=snap; Package: DIP-4 Isocom Components; Value: *; MP: TLP521-1; Check_prices: https://www.snapeda.com/parts/TLP521-1/Isocom/view-part/?ref=eda
Y1 = Crystal 16 Mhz SMD: 16 Mhz Crystal SMD –CSM-4ALX(28ALX) 12.5mmX4.85mmX4mm; MF: Fox Electronics; MP: FOXSDLF/128-20; SnapEDA_Link: https://www.snapeda.com/parts/FOXSDLF/128-20/Fox+Electronics/view-part/?ref=snap; Package: HC49SD Fox Electronics; Value: *; Check_prices: https://www.snapeda.com/parts/FOXSDLF/128-20/Fox+Electronics/view-part/?ref=eda

## Nets that join several sheets
+5: AVCC_01 (9 pins), AVCC_2 (6 pins)
+5DC: AVCC_2 (9 pins), AVCC_3 (24 pins)
+12: AVCC_2 (6 pins), AVCC_3 (11 pins)
GND: AVCC_01 (8 pins), AVCC_2 (26 pins), AVCC_3 (51 pins)
DTR: AVCC_2 (U2.13), AVCC_3 (C16.1)
RX_P: AVCC_2 (U2.2), AVCC_3 (J5.01 U3.2)
TX_N: AVCC_2 (U2.3), AVCC_3 (J5.03 U3.3)